# Altium schematic sheet Connectors.SchDoc
size A
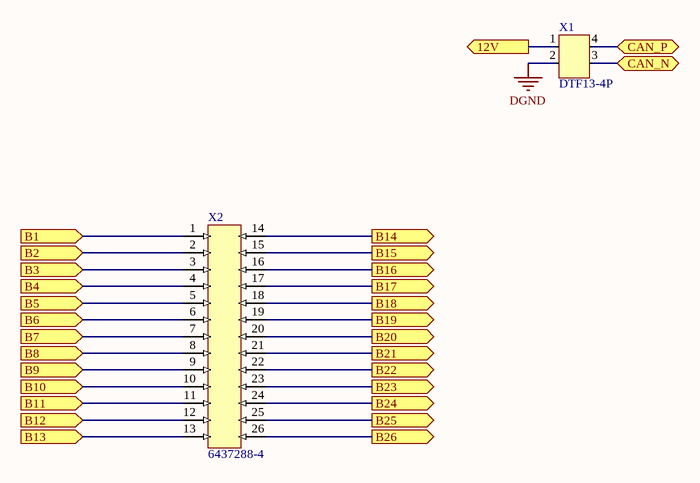
[diagram p0: Connectors.SchDoc]

## Parts
X1  DTF13-4P  [DTF13-4P]
X2  6437288-4  [SUPERSEAL 26POS 90Deg]

## Ports
12V (out), B1 (in), B2 (in), B3 (in), B4 (in), B5 (in), B6 (in), B7 (in), B8 (in), B9 (in), B10 (in), B11 (in), B12 (in), B13 (in), B14 (out), B15 (out), B16 (out), B17 (out), B18 (out), B19 (out), B20 (out), B21 (out), B22 (out), B23 (out), B24 (out), B25 (out), B26 (out), CAN_N (bidir), CAN_P (bidir)

## Nets
DGND: X1.2
12V: X1.1 ; port 12V
B1: X2.1 ; port B1
B2: X2.2 ; port B2
B3: X2.3 ; port B3
B4: X2.4 ; port B4
B5: X2.5 ; port B5
B6: X2.6 ; port B6
B7: X2.7 ; port B7
B8: X2.8 ; port B8
B9: X2.9 ; port B9
B10: X2.10 ; port B10
B11: X2.11 ; port B11
B12: X2.12 ; port B12
B13: X2.13 ; port B13
B14: X2.14 ; port B14
B15: X2.15 ; port B15
B16: X2.16 ; port B16
B17: X2.17 ; port B17
B18: X2.18 ; port B18
B19: X2.19 ; port B19
B20: X2.20 ; port B20
B21: X2.21 ; port B21
B22: X2.22 ; port B22
B23: X2.23 ; port B23
B24: X2.24 ; port B24
B25: X2.25 ; port B25
B26: X2.26 ; port B26
CAN_N: X1.3 ; port CAN_N
CAN_P: X1.4 ; port CAN_P

## Library data of the parts
X1 = 15: 2 row 4 pin Board; Manufacturer_id: 1; idConn: 15; Value: CONN; Num_Contacts: 4; Created_By: Angel; MfrPartNo: DTF13-4P; Drawer_id: 1; Name: DTF13-4P; Link: https://www.te.com/usa-en/product-DTF13-4P.html; ComponentLink1Description: Datasheet; Supplier1: TE
X2 = 21: 4 row connector; Manufacturer_id: 1; idConn: 21; Name: AMP Superseal 90Deg; Value: CONN; Num_Contacts: 26; Num_Rows: 4; Pitch: 3mm; Created_By: Angel; MfrPartNo: 6437288-4; Drawer_id: 1; Link: https://www.te.com/usa-en/product-6437288-4.html#guest-click; ComponentLink1Description: Datasheet; Supplier1: TE